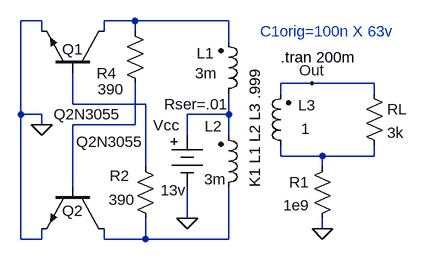
[diagram p0: schematic 12_220_PpMinimal.asc]
12_220_PpMinimal.asc, the LTspice schematic file:
Version 4
SHEET 1 880 680
WIRE -512 112 -544 112
WIRE -368 112 -416 112
WIRE -224 112 -368 112
WIRE -512 128 -512 112
WIRE -416 128 -416 112
WIRE -368 128 -368 112
WIRE -224 144 -224 112
WIRE -96 208 -144 208
WIRE 0 208 -96 208
WIRE -144 224 -144 208
WIRE 0 224 0 208
WIRE -464 240 -464 192
WIRE -352 240 -464 240
WIRE -544 256 -544 112
WIRE -512 256 -544 256
WIRE -224 256 -224 224
WIRE -224 256 -288 256
WIRE -512 272 -512 256
WIRE -368 272 -368 208
WIRE -368 272 -464 272
WIRE -288 288 -288 256
WIRE -224 288 -224 256
WIRE -144 320 -144 304
WIRE -80 320 -144 320
WIRE 0 320 0 304
WIRE 0 320 -80 320
WIRE -352 336 -352 240
WIRE -80 336 -80 320
WIRE -464 368 -464 272
WIRE -288 416 -288 368
WIRE -80 432 -80 416
WIRE -544 448 -544 256
WIRE -512 448 -512 432
WIRE -512 448 -544 448
WIRE -416 448 -416 432
WIRE -352 448 -352 416
WIRE -352 448 -416 448
WIRE -224 448 -224 368
WIRE -224 448 -352 448
FLAG -80 432 0
FLAG -288 416 0
FLAG -512 272 0
FLAG -96 208 Out
SYMBOL ind2 -240 240 M180
WINDOW 0 -33 78 Left 0
WINDOW 3 -36 47 Left 0
SYMATTR InstName L1
SYMATTR Value 3m
SYMBOL ind2 -240 384 M180
WINDOW 0 -21 110 Left 0
WINDOW 3 -22 28 Left 0
SYMATTR InstName L2
SYMATTR Value 3m
SYMBOL ind2 -128 320 R180
WINDOW 0 -38 78 Left 0
WINDOW 3 -29 42 Left 0
SYMATTR InstName L3
SYMATTR Value 1
SYMATTR SpiceLine Rser=1
SYMBOL res -64 320 M0
SYMATTR InstName R1
SYMATTR Value 1e9
SYMBOL npn2 -416 192 M270
WINDOW 0 36 64 VLeft 0
WINDOW 3 -64 77 VLeft 0
SYMATTR InstName Q1
SYMATTR Value Q2N3055
SYMBOL res -368 320 R0
WINDOW 0 -39 30 Left 0
WINDOW 3 -41 67 Left 0
SYMATTR InstName R2
SYMATTR Value 390
SYMBOL Misc\\battery -288 272 R0
WINDOW 0 -52 1 Left 0
WINDOW 3 -41 101 Left 0
WINDOW 123 0 0 Left 0
WINDOW 39 -35 -32 Left 0
SYMATTR InstName Vcc
SYMATTR Value 13v
SYMATTR SpiceLine Rser=.01
SYMBOL res -16 208 R0
SYMATTR InstName RL
SYMATTR Value 3k
SYMBOL npn2 -416 368 R90
WINDOW 0 36 64 VLeft 0
WINDOW 3 -70 43 VLeft 0
SYMATTR InstName Q2
SYMATTR Value Q2N3055
SYMBOL res -384 112 R0
WINDOW 0 -43 81 Left 0
WINDOW 3 -42 105 Left 0
SYMATTR InstName R4
SYMATTR Value 390
TEXT -184 184 VRight 0 !K1 L1 L2 L3 .999
TEXT -144 168 Left 0 !.tran 200m
TEXT -176 128 Left 0 ;C1orig=100n X 63v

The netlist it stands for:
* 12_220_PpMinimal.asc
L1 N003 N001 3m
L2 N006 N003 3m
L3 N005 Out 1 Rser=1
R1 N005 0 1e9
Q1 N001 N002 0 0 Q2N3055
R2 N002 N006 390
Vcc N003 0 13v Rser=.01
RL Out N005 3k
Q2 N006 N004 0 0 Q2N3055
R4 N001 N004 390
.model NPN NPN
.model PNP PNP
.lib standard.bjt
K1 L1 L2 L3 .999
.tran 200m
* C1orig=100n X 63v
.backanno
.end